# EasyEDA Pro project Demo.eprj

# Schematic Schematic1
Board Name: Board1; Create Date: 2024-12-16; Page Name: P1; Project Name: Demo; Schematic Name: Schematic1; Update Date: 2024-12-16; Company: EasyEDA.com; Page Size: A4; Version: V1.0
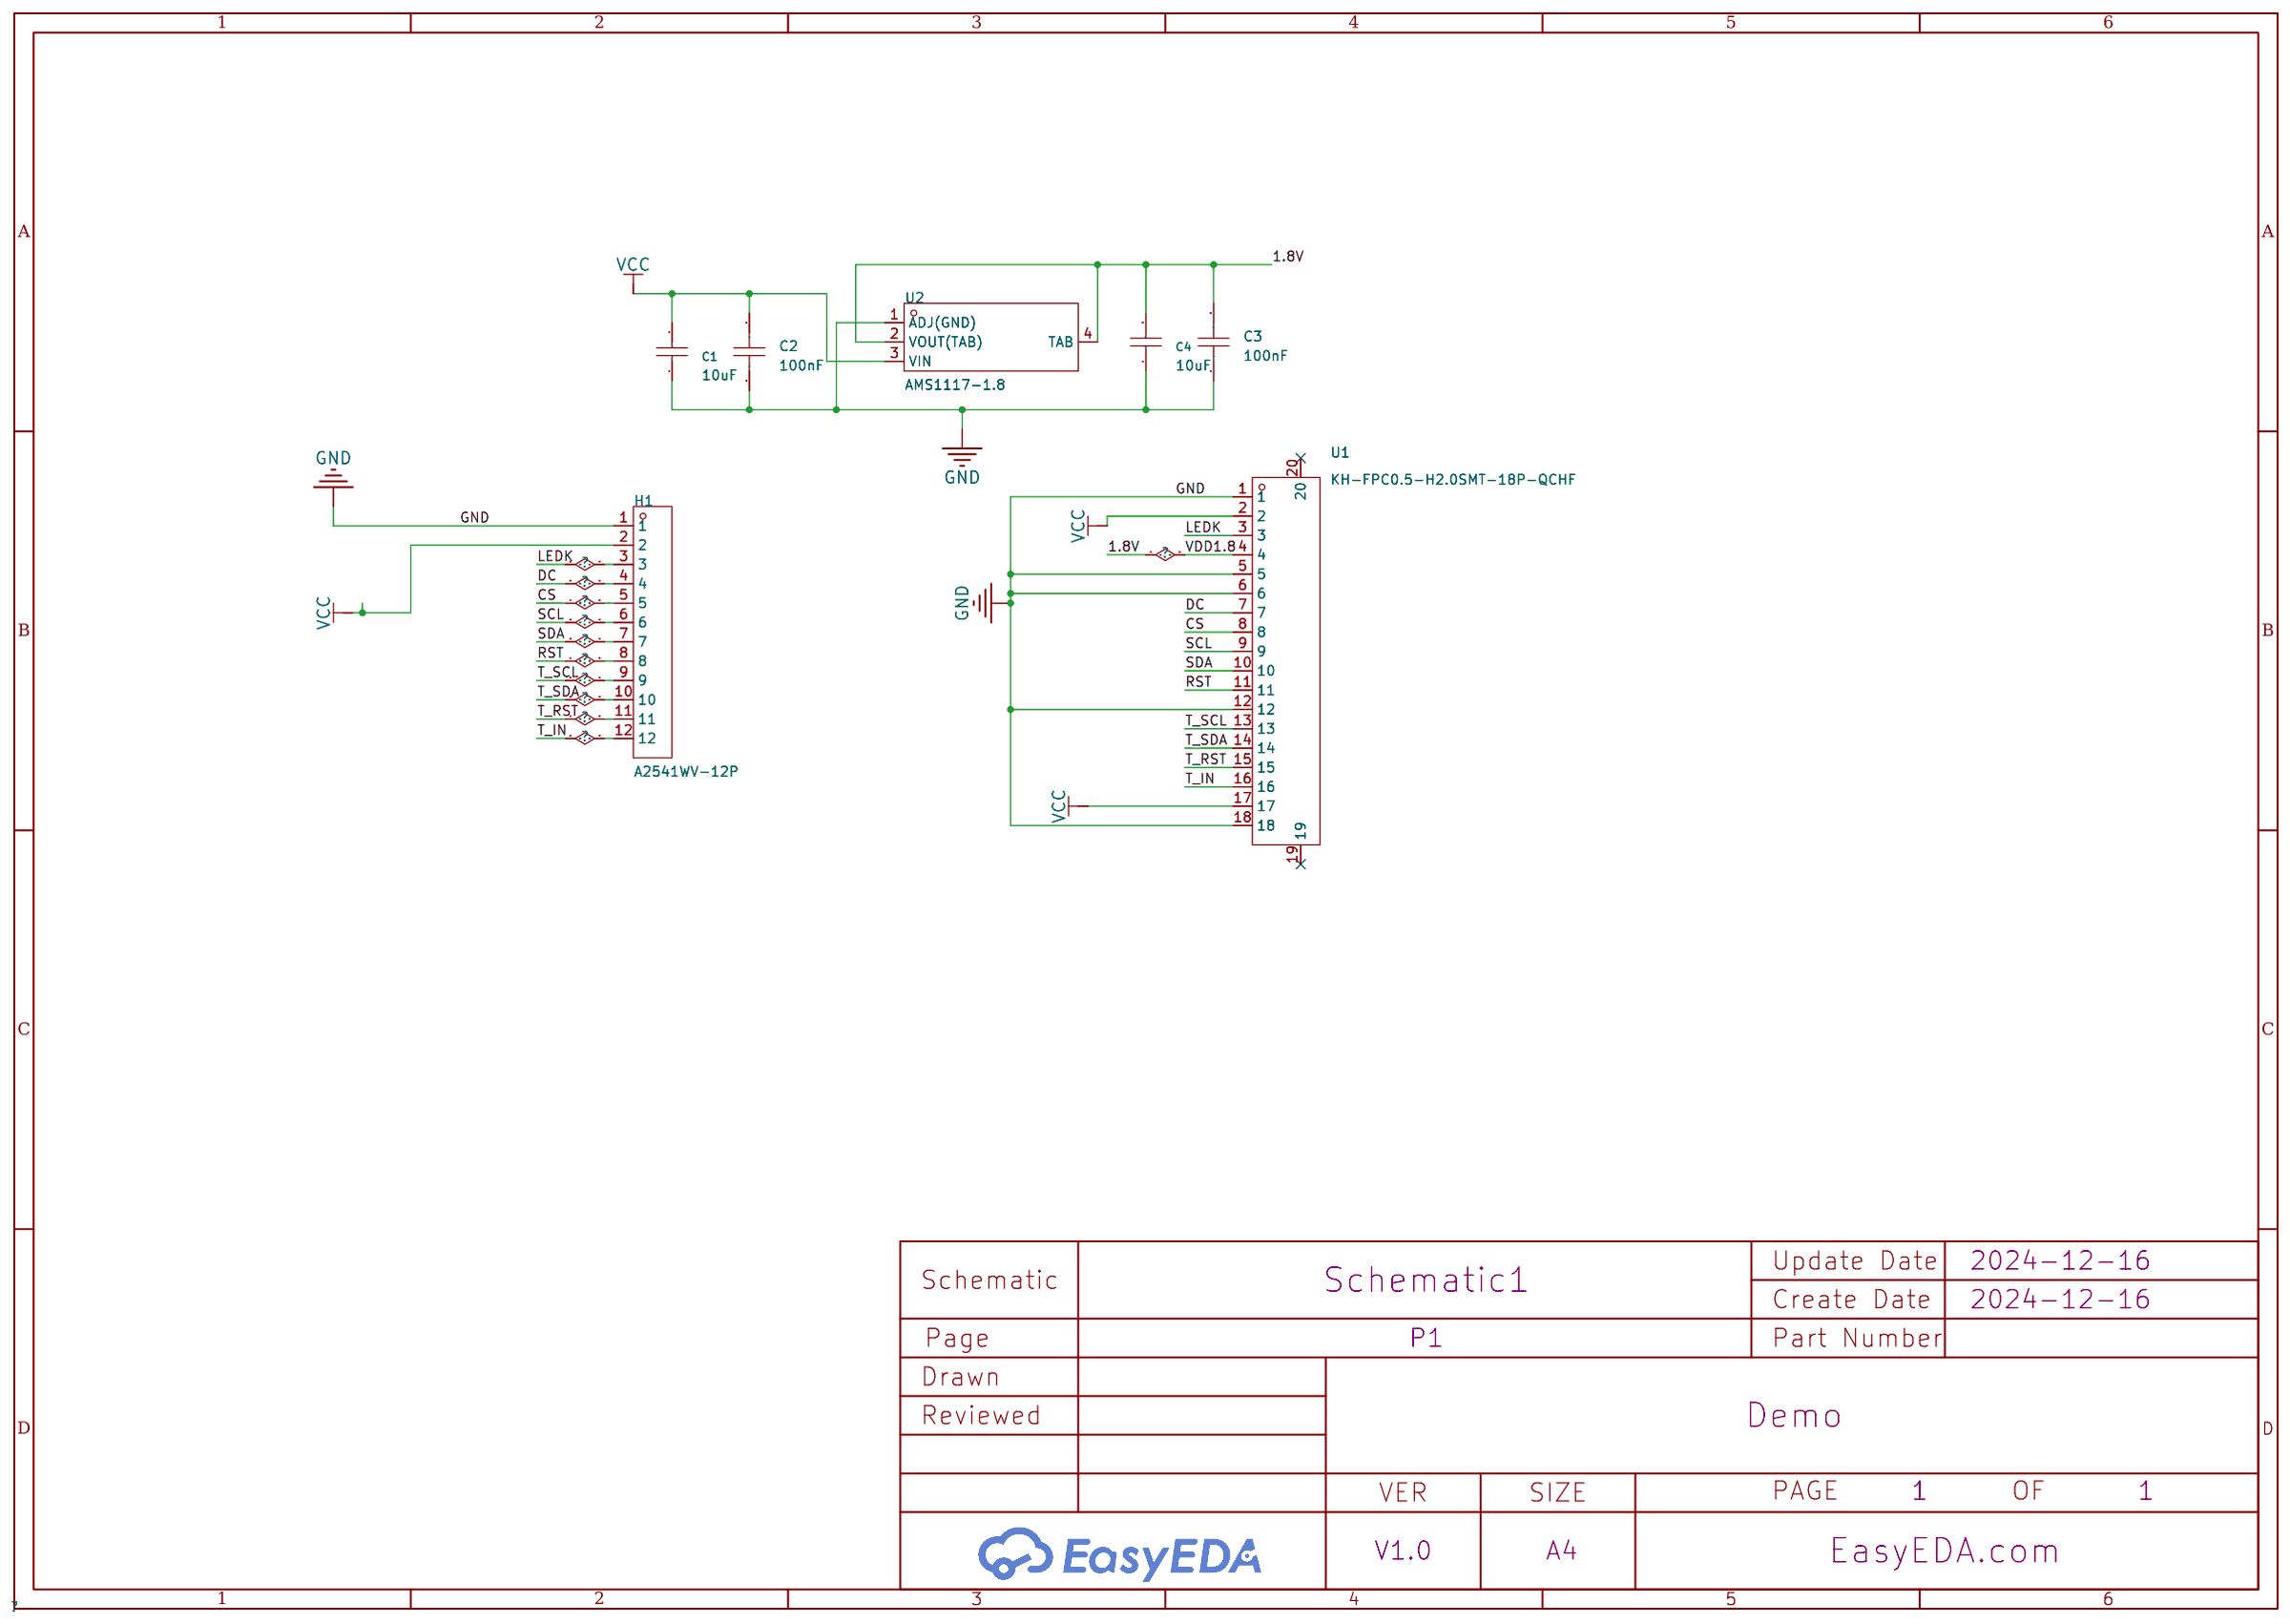
[diagram p0: schematic sheet]

## Parts
C1  10uF  [C0805]
C2  100nF  [C0603]
C3  100nF  [C0603]
C4  10uF  [C0805]
H1  A2541WV-12P  [HDR-TH_12P-P2.54-V-M]
U1  KH-FPC0.5-H2.0SMT-18P-QCHF  [FPC-SMD_18P-P0.50_HDGC_0.5K-DX-18PWBG]
U2  AMS1117-1.8  [SOT-223_L6.7-W3.5-P2.30-BR]

## Library data of the parts
C1 C4 = CL21A106KPFNNNE: Capacitance: Tolerance:±10% Tolerance:±10% Voltage Rated: Temperature Coefficient:; LCSC Part Name: 10uF ±10% 10V; Supplier Part: C17024; Manufacturer: SAMSUNG(三星); Supplier Footprint: 0805; JLCPCB Part Class: Extended Part; Datasheet: https://atta.szlcsc.com/upload/public/pdf/source/20160218/1457707763339.pdf; Supplier: LCSC; Tolerance: ±10%
C2 C3 = CGA0603X7R104K500JT: Capacitance:100nF Tolerance:±10% Tolerance:±10% Voltage Rated:50V Temperature Coefficient:; LCSC Part Name: 100nF ±10% 50V; Supplier Part: C6119867; Manufacturer: HRE(芯声); Supplier Footprint: 0603; JLCPCB Part Class: Extended Part; Supplier: LCSC; Tolerance: ±10%; Voltage Rated: 50V
H1 = A2541WV-12P: LCSC Part Name: 1x12P 间距:2.54mm 方针 直插; Supplier Part: C1121851; Manufacturer: CJT(长江连接器); Supplier Footprint: 插件,P=2.54mm; JLCPCB Part Class: Extended Part; Datasheet: https://atta.szlcsc.com/upload/public/pdf/source/20190522/C339348_148DC62DFEE35B66DE27661541078F4A.pdf; Supplier: LCSC; Pin Structure: 1x12P; Pitch: 2.54mm; Circluar Pins/Square Pins: Square Pins; Mounting Type: Straight; Number of Rows: Plugin; Number of Pins: 12P; Current Rating (Max): 3A; Voltage Rating (Max): 250V; Length of Mating Pin: 6mm; Insulation Height: 2.54mm; Length of End Connection Pin: 3mm; Contact Plating: Gold; Operating Temperature Range: -40℃~+105℃; Color: Black
U1 = KH-FPC0.5-H2.0SMT-18P-QCHF: Supplier Part: C3249996; Manufacturer: kinghelm(金航标); Supplier Footprint: SMD,P=0.5mm; JLCPCB Part Class: Extended Part; Datasheet: https://atta.szlcsc.com/upload/public/pdf/source/20220629/0C8C5329E03AE4678B0B24A2A81D42D9.pdf; Supplier: LCSC; Locking Feature: Clamshell; Number of Contacts: 18P; Pitch: 0.5mm; Height Above Board: 2mm
U2 = AMS1117-1.8_C347220: LCSC Part Name: 输出:1.8V 电流:1A 耐压:12V; Supplier Part: C347220; Manufacturer: UMW(友台半导体); Supplier Footprint: SOT-223; JLCPCB Part Class: Extended Part; Datasheet: https://atta.szlcsc.com/upload/public/pdf/source/20231109/155D79A26D9DB04352555A58D5969DC8.pdf; Supplier: LCSC; Maximum Input Voltage: 12V; Output Voltage: 1.8V; MAX Output Current: 1A; Power Supply Rejection Ratio (PSRR): 60dB@(120Hz); Dropout Voltage: 1.3V@(1A); Output Polarity: Positive electrode; Number of Outputs: 1

## Nets
1.8V: C3.2 C4.2 U1.4 U2.2(VOUT(TAB)) U2.4(TAB)
GND: C1.1 C2.1 C3.1 C4.1 H1.1 U1.1 U1.5 U1.6 U1.12 U1.18 U2.1(ADJ(GND))
VCC: C1.2 C2.2 H1.2 U1.2 U1.17 U2.3(VIN)
CS: H1.5 U1.8
DC: H1.4 U1.7
LEDK: H1.3 U1.3
RST: H1.8 U1.11
SCL: H1.6 U1.9
SDA: H1.7 U1.10
T_IN: H1.12 U1.16
T_RST: H1.11 U1.15
T_SCL: H1.9 U1.13
T_SDA: H1.10 U1.14

Not connected (* = marked no-connect by the designer): U1 19* 20*

# Board PCB1
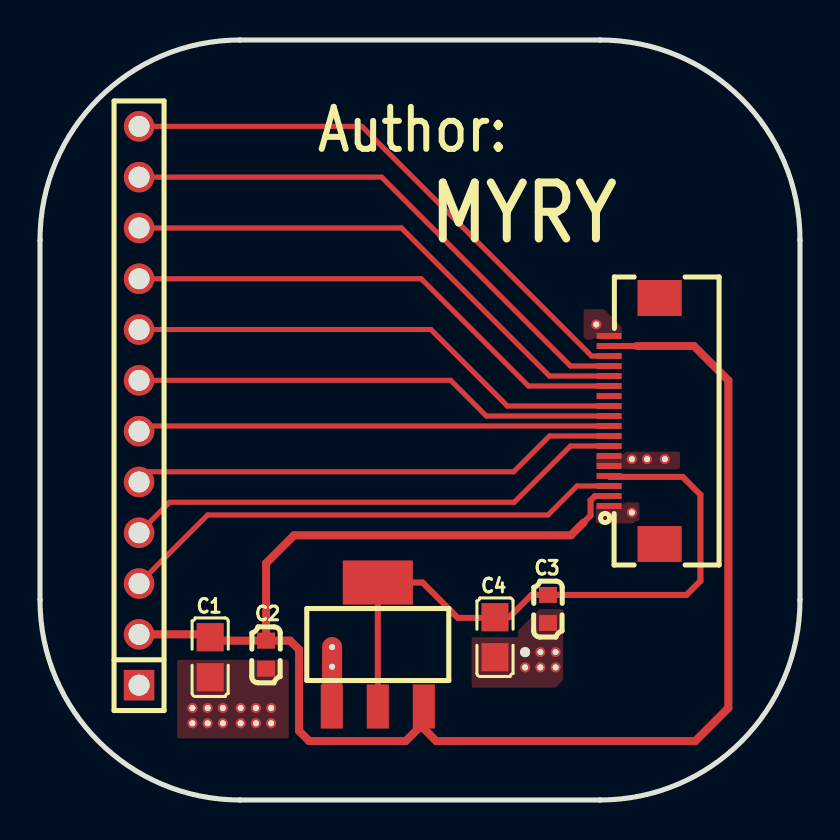
[diagram p1: board, top side]
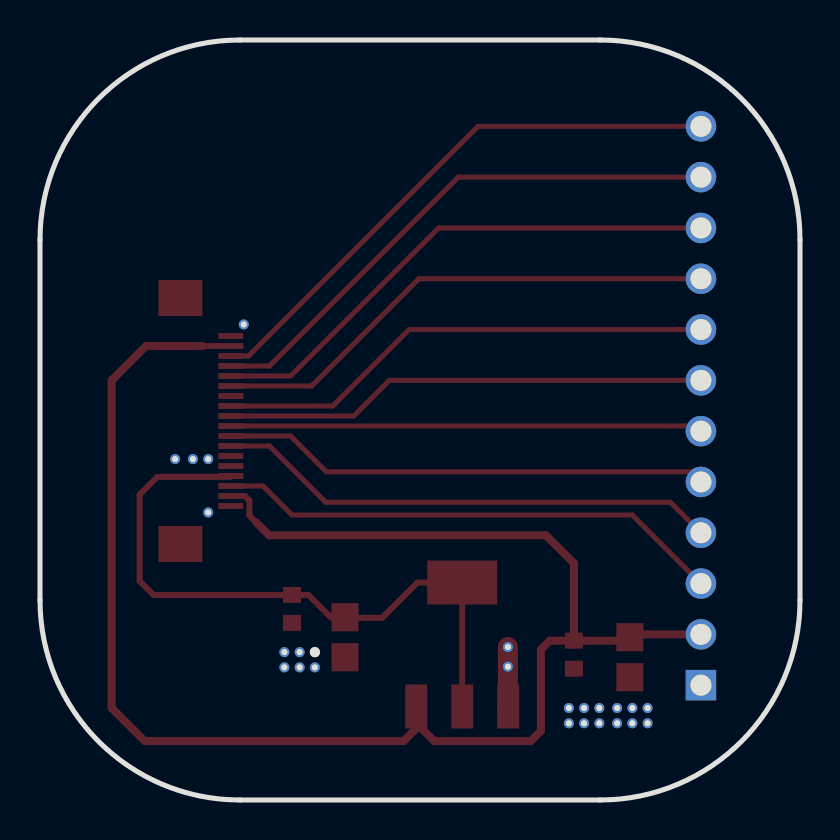
[diagram p2: board, bottom side, seen from below]

Outline 38 x 38 mm; copper layers: Top Layer, Bottom Layer. Coordinates in mm from the lower left corner of the outline.
Outline path: 0,28 0,10 arc(2.93,2.93) 10,0 28,0 arc(35.07,2.93) 38,10 38,28 arc(35.07,35.07) 28,38 10,38 arc(2.93,35.07) 0,28
Stack: Top Layer 0.035mm / Dielectric1 1.51mm FR4 er 4.5 / Bottom Layer 0.035mm

## Design rules (mm)
template: Custom Config
spacing copperThickness1oz (default): track to track 0.102, other pairs 0.152 to 0.3
spacing copperThickness2oz: track to track 0.203, other pairs 0.152 to 0.3
track width copperThickness1oz (default): min 0.127, default 0.254, max 2.54
track width copperThickness2oz: min 0.203, default 0.254, max 2.54
differential pair differentialPair (default): width min 0.127, default 0.254, max 2.54; gap min 0.152, default 0.152
via viaSize (default): diameter min 0.5, default 0.61, max 10; hole min 0.3, default 0.305, max 6.3

## Placement (name value [footprint] x y rotation side)
C1  10uF  [C0805]  8.51 7.14 90 top
C2  100nF  [C0603]  11.3 7.27 90 top
C3  100nF  [C0603]  25.4 9.55 90 top
C4  10uF  [C0805]  22.75 8.14 90 top
H1  A2541WV-12P  [HDR-TH_12P-P2.54-V-M]  4.95 19.71 90 top
NOREF  -  [Pad_e451]  14.6 6.66 0 top
NOREF#2  -  [Pad_e463]  10.03 4.6 0 top
NOREF#3  -  [Pad_e464]  10.03 3.84 0 top
NOREF#4  -  [Pad_e580]  29.59 17.05 0 top
NOREF#5  -  [Pad_e467]  11.56 4.6 0 top
NOREF#6  -  [Pad_e585]  27.81 23.78 0 top
NOREF#7  -  [Pad_e470]  7.62 3.84 0 top
NOREF#8  -  [Pad_e465]  10.79 3.84 0 top
NOREF#9  -  [Pad_e472]  9.14 3.84 0 top
NOREF#10  -  [Pad_e582]  31.24 17.05 0 top
NOREF#11  -  [Pad_e581]  30.35 17.05 0 top
NOREF#12  -  [Pad_e338]  24.26 7.39 0 top
NOREF#13  -  [Pad_e468]  8.38 4.6 0 top
NOREF#14  -  [Pad_e466]  11.56 3.84 0 top
NOREF#15  -  [Pad_e471]  8.38 3.84 0 top
NOREF#16  -  [Pad_e469]  7.62 4.6 0 top
NOREF#17  -  [Pad_e473]  9.14 4.6 0 top
NOREF#18  -  [Pad_e340]  25.02 7.39 0 top
NOREF#19  -  [Pad_e342]  24.26 6.63 0 top
NOREF#20  -  [Pad_e344]  25.78 6.63 0 top
NOREF#21  -  [Pad_e566]  29.59 14.38 0 top
NOREF#22  -  [Pad_e341]  25.78 7.39 0 top
NOREF#23  -  [Pad_e343]  25.02 6.63 0 top
NOREF#24  -  [Pad_e450]  14.6 7.65 0 top
NOREF#25  -  [Pad_e462]  10.79 4.6 0 top
U1  KH-FPC0.5-H2.0SMT-18P-QCHF  [FPC-SMD_18P-P0.50_HDGC_0.5K-DX-18PWBG]  29.72 18.95 90 top
U2  AMS1117-1.8  [SOT-223_L6.7-W3.5-P2.30-BR]  16.89 7.77 270 top

## Footprints (pads in the part's own frame, mm; a bottom-side part is the same pattern mirrored in y, then rotated)
C0603
  rect 0.8x0.9 smd: 1(-0.7,0) 2(0.7,0)
C0805
  rect 1.41x1.35 smd: 1(-1,0) 2(1,0)
FPC-SMD_18P-P0.50_HDGC_0.5K-DX-18PWBG
  rect 0.3x1.25 smd: 1(-4.25,1.262) 2(-3.75,1.262) 3(-3.25,1.262) 4(-2.75,1.262) 5(-2.25,1.262) 6(-1.75,1.262) 7(-1.25,1.262) 8(-0.75,1.262) 9(-0.25,1.262) 10(0.25,1.262) 11(0.75,1.262) 12(1.25,1.262) 13(1.75,1.262) 14(2.25,1.262) 15(2.75,1.262) 16(3.25,1.262) 17(3.75,1.262) 18(4.25,1.262)
  rect 1.8x2.2 smd: 19(6.15,-1.262) 20(-6.15,-1.262)
HDR-TH_12P-P2.54-V-M
  rect 1.524x1.524 hole 1.05: 1(-13.97,0)
  round 1.524 hole 1.05: 2(-11.43,0) 3(-8.89,0) 4(-6.35,0) 5(-3.81,0) 6(-1.27,0) 7(1.27,0) 8(3.81,0) 9(6.35,0) 10(8.89,0) 11(11.43,0) 12(13.97,0)
Pad_e338
  round 0.5 hole 0.914x0.3: 1(0,0)
Pad_e340
  round 0.5 hole 0.3: 1(0,0)
Pad_e341
  round 0.5 hole 0.3: 1(0,0)
Pad_e342
  round 0.5 hole 0.3: 1(0,0)
Pad_e343
  round 0.5 hole 0.3: 1(0,0)
Pad_e344
  round 0.5 hole 0.3: 1(0,0)
Pad_e450
  round 0.5 hole 0.3: 1(0,0)
Pad_e451
  round 0.5 hole 0.3: 1(0,0)
Pad_e462
  round 0.5 hole 0.3: 1(0,0)
Pad_e463
  round 0.5 hole 0.3: 1(0,0)
Pad_e464
  round 0.5 hole 0.3: 1(0,0)
Pad_e465
  round 0.5 hole 0.3: 1(0,0)
Pad_e466
  round 0.5 hole 0.3: 1(0,0)
Pad_e467
  round 0.5 hole 0.3: 1(0,0)
Pad_e468
  round 0.5 hole 0.3: 1(0,0)
Pad_e469
  round 0.5 hole 0.3: 1(0,0)
Pad_e470
  round 0.5 hole 0.3: 1(0,0)
Pad_e471
  round 0.5 hole 0.3: 1(0,0)
Pad_e472
  round 0.5 hole 0.3: 1(0,0)
Pad_e473
  round 0.5 hole 0.3: 1(0,0)
Pad_e566
  round 0.5 hole 0.3: 1(0,0)
Pad_e580
  round 0.5 hole 0.3: 1(0,0)
Pad_e581
  round 0.5 hole 0.3: 1(0,0)
Pad_e582
  round 0.5 hole 0.3: 1(0,0)
Pad_e585
  round 0.5 hole 0.3: 1(0,0)
SOT-223_L6.7-W3.5-P2.30-BR
  rect 2.2x1.1 smd: 1(3.099,-2.3) 2(3.099,0) 3(3.099,2.3)
  rect 2.2x3.5 smd: 4(-3.099,0)

## Nets
As in the schematic, except:
GND: C1.1 C2.1 C3.1 C4.1 H1.1 NOREF.1 NOREF#2.1 NOREF#3.1 NOREF#4.1 NOREF#5.1 NOREF#6.1 NOREF#7.1 NOREF#8.1 NOREF#9.1 NOREF#10.1 NOREF#11.1 NOREF#12.1 NOREF#13.1 NOREF#14.1 NOREF#15.1 NOREF#16.1 NOREF#17.1 NOREF#18.1 NOREF#19.1 NOREF#20.1 NOREF#21.1 NOREF#22.1 NOREF#23.1 NOREF#24.1 NOREF#25.1 U1.1 U1.5 U1.6 U1.12 U1.18 U2.1

Pads without a net: U1 19 20

## Routing (per net, layer and track width the routed paths; a pad name or vN(x,y) marks a point on that pad's centre or on a via; arc(x,y) is an arc through that point)
1.8V: length 33.1
  Top Layer w0.3: U1.4 28.5,16.16 32.13,16.16 33.02,15.27 33.02,10.95 32.32,10.25 C3.2 24.58,10.25 23.46,9.14 C4.2 22.72,9.11 20.89,9.11 19.13,10.87 U2.4 U2.2
GND: length 3
  Top Layer w1: U2.1 14.6,4.69 NOREF.1 NOREF#24.1
VCC: length 82.4
  Top Layer w0.3: 29.84,22.7 U1.17 ; U1.2 27.75,15.2 27.53,14.97 27.53,14.22 27.18,13.87
  Top Layer w0.4: C1.2 8.37,8.28 H1.2 ; 19.19,3.85 U2.3 ; 19.19,3.85 19.19,3.57 19.81,2.95 32.77,2.95 34.42,4.6 34.42,20.98 32.7,22.7 29.84,22.7 ; 19.19,3.85 18.29,2.95 13.46,2.95 12.95,3.46 12.95,7.52 12.51,7.97 C2.2 ; C2.2 8.68,7.97 ; C2.2 11.3,11.84 12.7,13.23 26.54,13.23 27.18,13.87
  Top Layer w0.5: C1.2 8.68,7.97
CS: length 24.5
  Top Layer w0.254: U1.8 25.47,18.2 23.68,16.41 5.46,16.41 H1.5
DC: length 25.3
  Top Layer w0.254: U1.7 26.52,17.7 23.71,14.89 6.48,14.89 H1.4
LEDK: length 25.5
  Top Layer w0.254: H1.3 8.38,14.25 25.4,14.25 26.85,15.7 U1.3
RST: length 25.1
  Top Layer w0.254: U1.11 23.37,19.7 19.55,23.52 H1.8
SCL: length 23.6
  Top Layer w0.254: H1.6 5.21,18.7 U1.9
SDA: length 24.2
  Top Layer w0.254: H1.7 20.53,20.98 22.32,19.2 U1.10
T_IN: length 28.3
  Top Layer w0.254: H1.12 16.09,33.68 27.58,22.2 U1.16
T_RST: length 27.4
  Top Layer w0.254: H1.11 17.08,31.14 26.52,21.7 U1.15
T_SCL: length 25.7
  Top Layer w0.254: U1.13 24.42,20.7 19.06,26.06 H1.9
T_SDA: length 26.6
  Top Layer w0.254: H1.10 18.07,28.6 25.47,21.2 U1.14

## Copper pours and planes (outline as drawn; the poured copper is in the pictures)
GND on Top Layer: 27.81,17.43 27.81,16.54 32,16.54 32,17.43 31.6,17.43
GND on Top Layer: -59.31,40.16 -13.08,40.16 -13.08,-1.37 -59.31,-1.37
GND on Top Layer: 21.17,8.14 21.17,5.49 25.4,5.49 26.54,6.63 26.54,9.53 24.62,9.53 24.3,9.21 24.3,8.18 24.26,8.14
GND on Top Layer: 6.86,7.01 6.86,3.08 12.45,3.08 12.45,7.01
GND on Top Layer: 27.78,14.89 27.78,13.83 29.97,13.83 29.97,14.88 29.97,14.89
GND on Top Layer: 29.08,23.01 29.08,23.65 28.19,24.54 27.18,24.54 27.18,23.01
GND on Top Layer: 21.58,8.14 21.58,5.61 25.78,5.61 26.16,6 26.16,9.54 24.97,9.54 23.91,8.48 23.91,8.16 23.88,8.14
GND on Bottom Layer: 52.45,40.35 98.68,40.35 98.68,-1.18 52.45,-1.18

## Text on the board
Top Silkscreen Layer: Author: | MYRY
